# Altium schematic sheet Keypad.SchDoc
size A
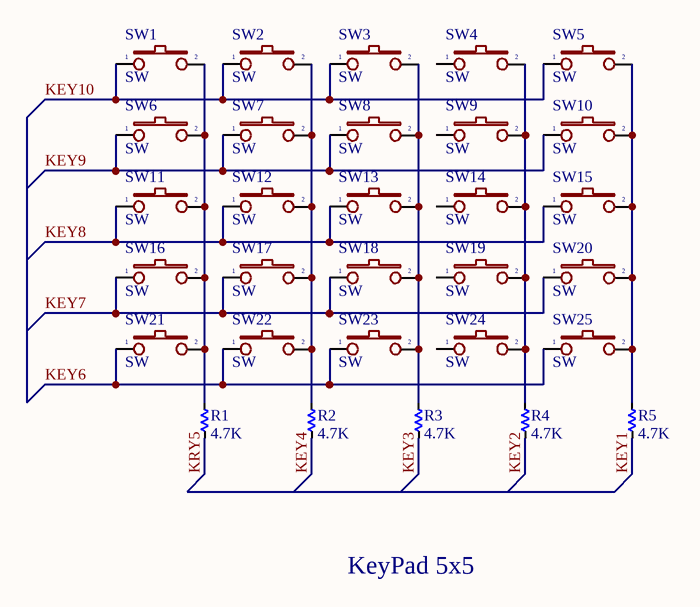
[diagram p0: Keypad.SchDoc]

## Parts
R1  4.7K  [RES-1/2W]
R2  4.7K  [RES-1/2W]
R3  4.7K  [RES-1/2W]
R4  4.7K  [RES-1/2W]
R5  4.7K  [RES-1/2W]
SW1  SW  [SW-DIP1-1]
SW2  SW  [SW-DIP1-1]
SW3  SW  [SW-DIP1-1]
SW4  SW  [SW-DIP1-1]
SW5  SW  [SW-DIP1-1]
SW6  SW  [SW-DIP1-1]
SW7  SW  [SW-DIP1-1]
SW8  SW  [SW-DIP1-1]
SW9  SW  [SW-DIP1-1]
SW10  SW  [SW-DIP1-1]
SW11  SW  [SW-DIP1-1]
SW12  SW  [SW-DIP1-1]
SW13  SW  [SW-DIP1-1]
SW14  SW  [SW-DIP1-1]
SW15  SW  [SW-DIP1-1]
SW16  SW  [SW-DIP1-1]
SW17  SW  [SW-DIP1-1]
SW18  SW  [SW-DIP1-1]
SW19  SW  [SW-DIP1-1]
SW20  SW  [SW-DIP1-1]
SW21  SW  [SW-DIP1-1]
SW22  SW  [SW-DIP1-1]
SW23  SW  [SW-DIP1-1]
SW24  SW  [SW-DIP1-1]
SW25  SW  [SW-DIP1-1]

## Nets
KEY1: R5.2
KEY2: R4.2
KEY3: R3.2
KEY4: R2.2
KEY6: SW21.1 SW22.1 SW23.1 SW25.1
KEY7: SW16.1 SW17.1 SW18.1 SW20.1
KEY8: SW11.1 SW12.1 SW13.1 SW15.1
KEY9: SW6.1 SW7.1 SW8.1 SW10.1
KEY10: SW1.1 SW2.1 SW3.1 SW5.1
KRY5: R1.2
NetR1_1: R1.1 SW1.2 SW6.2 SW11.2 SW16.2 SW21.2
NetR2_1: R2.1 SW2.2 SW7.2 SW12.2 SW17.2 SW22.2
NetR3_1: R3.1 SW3.2 SW8.2 SW13.2 SW18.2 SW23.2
NetR4_1: R4.1 SW4.2 SW9.2 SW14.2 SW19.2 SW24.2
NetR5_1: R5.1 SW5.2 SW10.2 SW15.2 SW20.2 SW25.2

Not connected (* = marked no-connect by the designer): SW4 1; SW9 1; SW14 1; SW19 1; SW24 1

## Notes on the sheet
- KeyPad 5x5

## Library data of the parts
R1-R5 = Res: Manufacturer: Generic Components; Class: Passive; SubClass: R; Published: 08/06/2000; Publisher: Altium Hobart Technology Centre
SW1-SW25 = SW2: Switch button 2 pin; Value: SW chip 2 pin